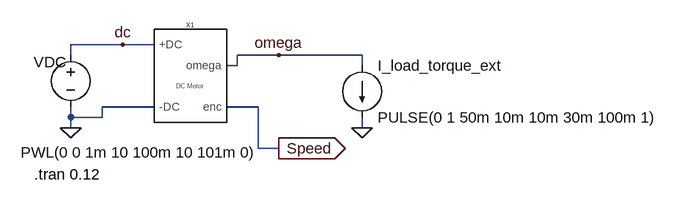
[diagram p0: schematic DC_motor_model_test.asc]
DC_motor_model_test.asc, the LTspice schematic file:
Version 4
SHEET 1 964 680
WIRE 64 64 -16 64
WIRE 112 64 64 64
WIRE -16 80 -16 64
WIRE 304 80 240 80
WIRE 432 80 304 80
WIRE 240 96 240 80
WIRE 240 96 224 96
WIRE 432 96 432 80
WIRE 112 160 32 160
WIRE 272 160 224 160
WIRE -16 176 -16 160
WIRE 32 176 32 160
WIRE 32 176 -16 176
WIRE -16 192 -16 176
WIRE 432 192 432 176
WIRE 272 224 272 160
WIRE 304 224 272 224
FLAG -16 192 0
FLAG 432 192 0
FLAG 304 224 Speed
IOPIN 304 224 Out
FLAG 304 80 omega
FLAG 64 64 dc
SYMBOL voltage -16 64 R0
WINDOW 0 -57 27 Left 2
WINDOW 3 -77 166 Left 2
WINDOW 123 0 0 Left 2
WINDOW 39 0 0 Left 2
SYMATTR InstName VDC
SYMATTR Value PWL(0 0 1m 10 100m 10 101m 0)
SYMBOL current 432 96 R0
WINDOW 123 0 0 Left 2
WINDOW 39 0 0 Left 2
SYMATTR InstName I_load_torque_ext
SYMATTR Value PULSE(0 1 50m 10m 10m 30m 100m 1)
SYMBOL DC_motor_model 160 112 R0
SYMATTR InstName X1
TEXT -72 264 Left 2 !.tran 0.12

The netlist it stands for:
* DC_motor_model_test.asc
VDC dc 0 PWL(0 0 1m 10 100m 10 101m 0)
I_load_torque_ext omega 0 PULSE(0 1 50m 10m 10m 30m 100m 1)
XX1 dc 0 Speed omega DC_motor_model  ; pins +DC -DC enc omega
.tran 0.12
.backanno
.end